# Altium schematic sheet TopLevel.SchDoc
size A4; SheetNumber: 1; SheetTotal: 4
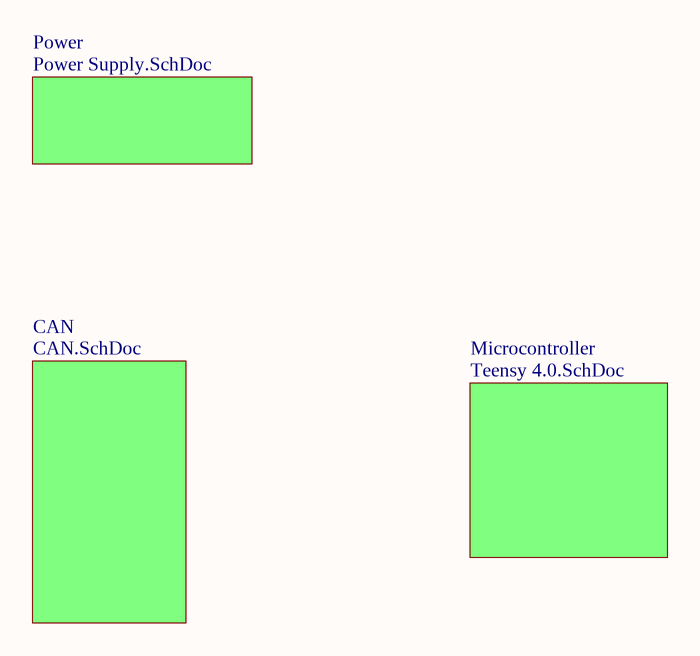
[diagram p0: TopLevel.SchDoc]

## Sub-sheets
CAN = CAN.SchDoc: no entries
Microcontroller = Teensy 4.0.SchDoc: no entries
Power = Power Supply.SchDoc: no entries